# EAGLE schematic mainboard (EAGLE 6.5.0)
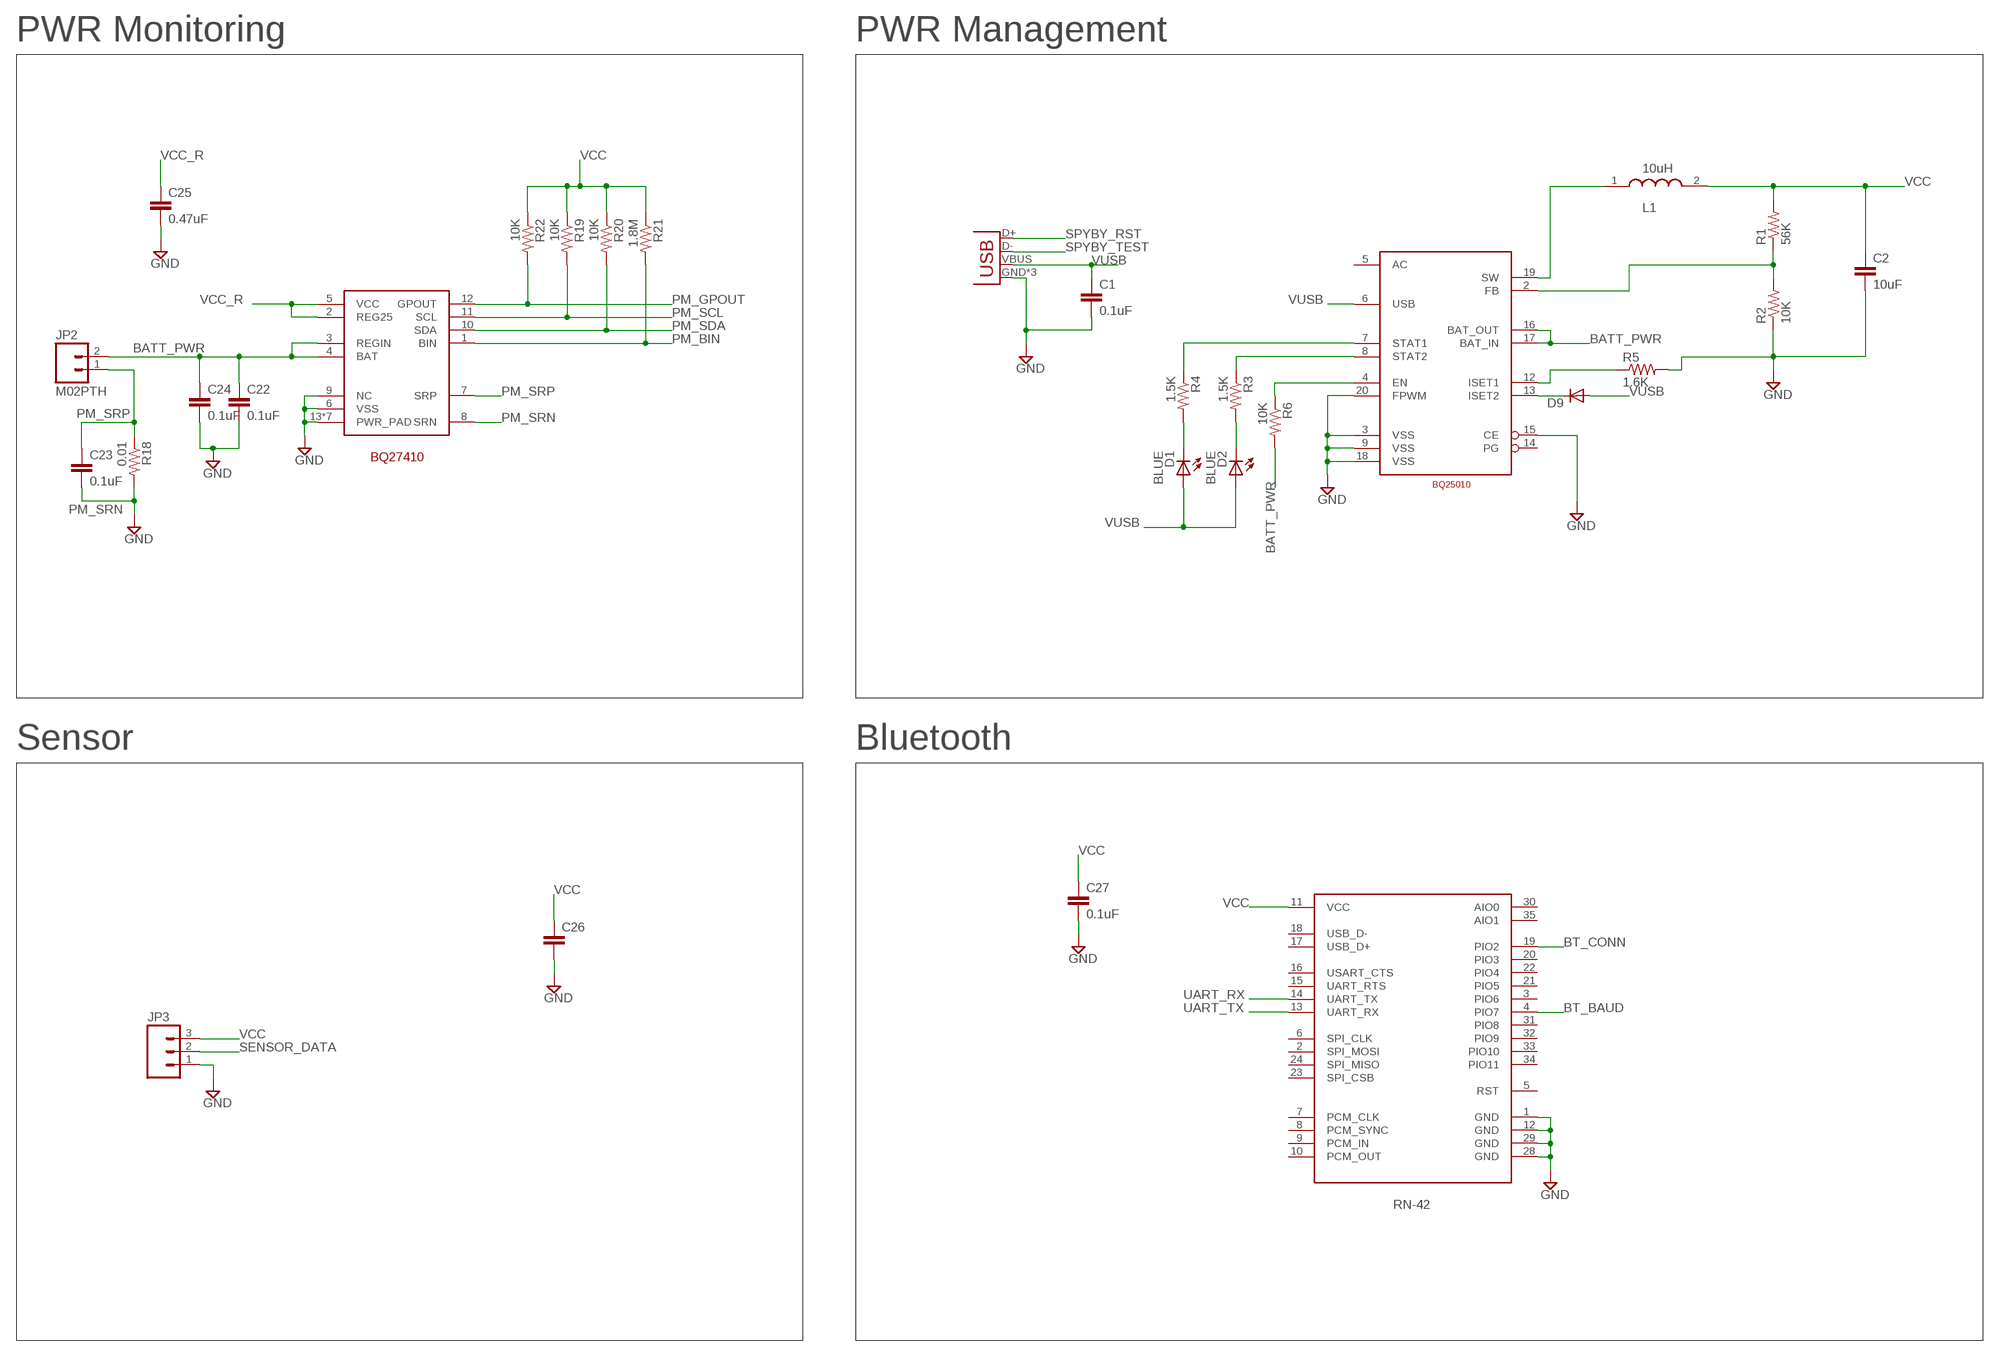
[diagram p0: schematic, sheet 1, part 1 of 2]
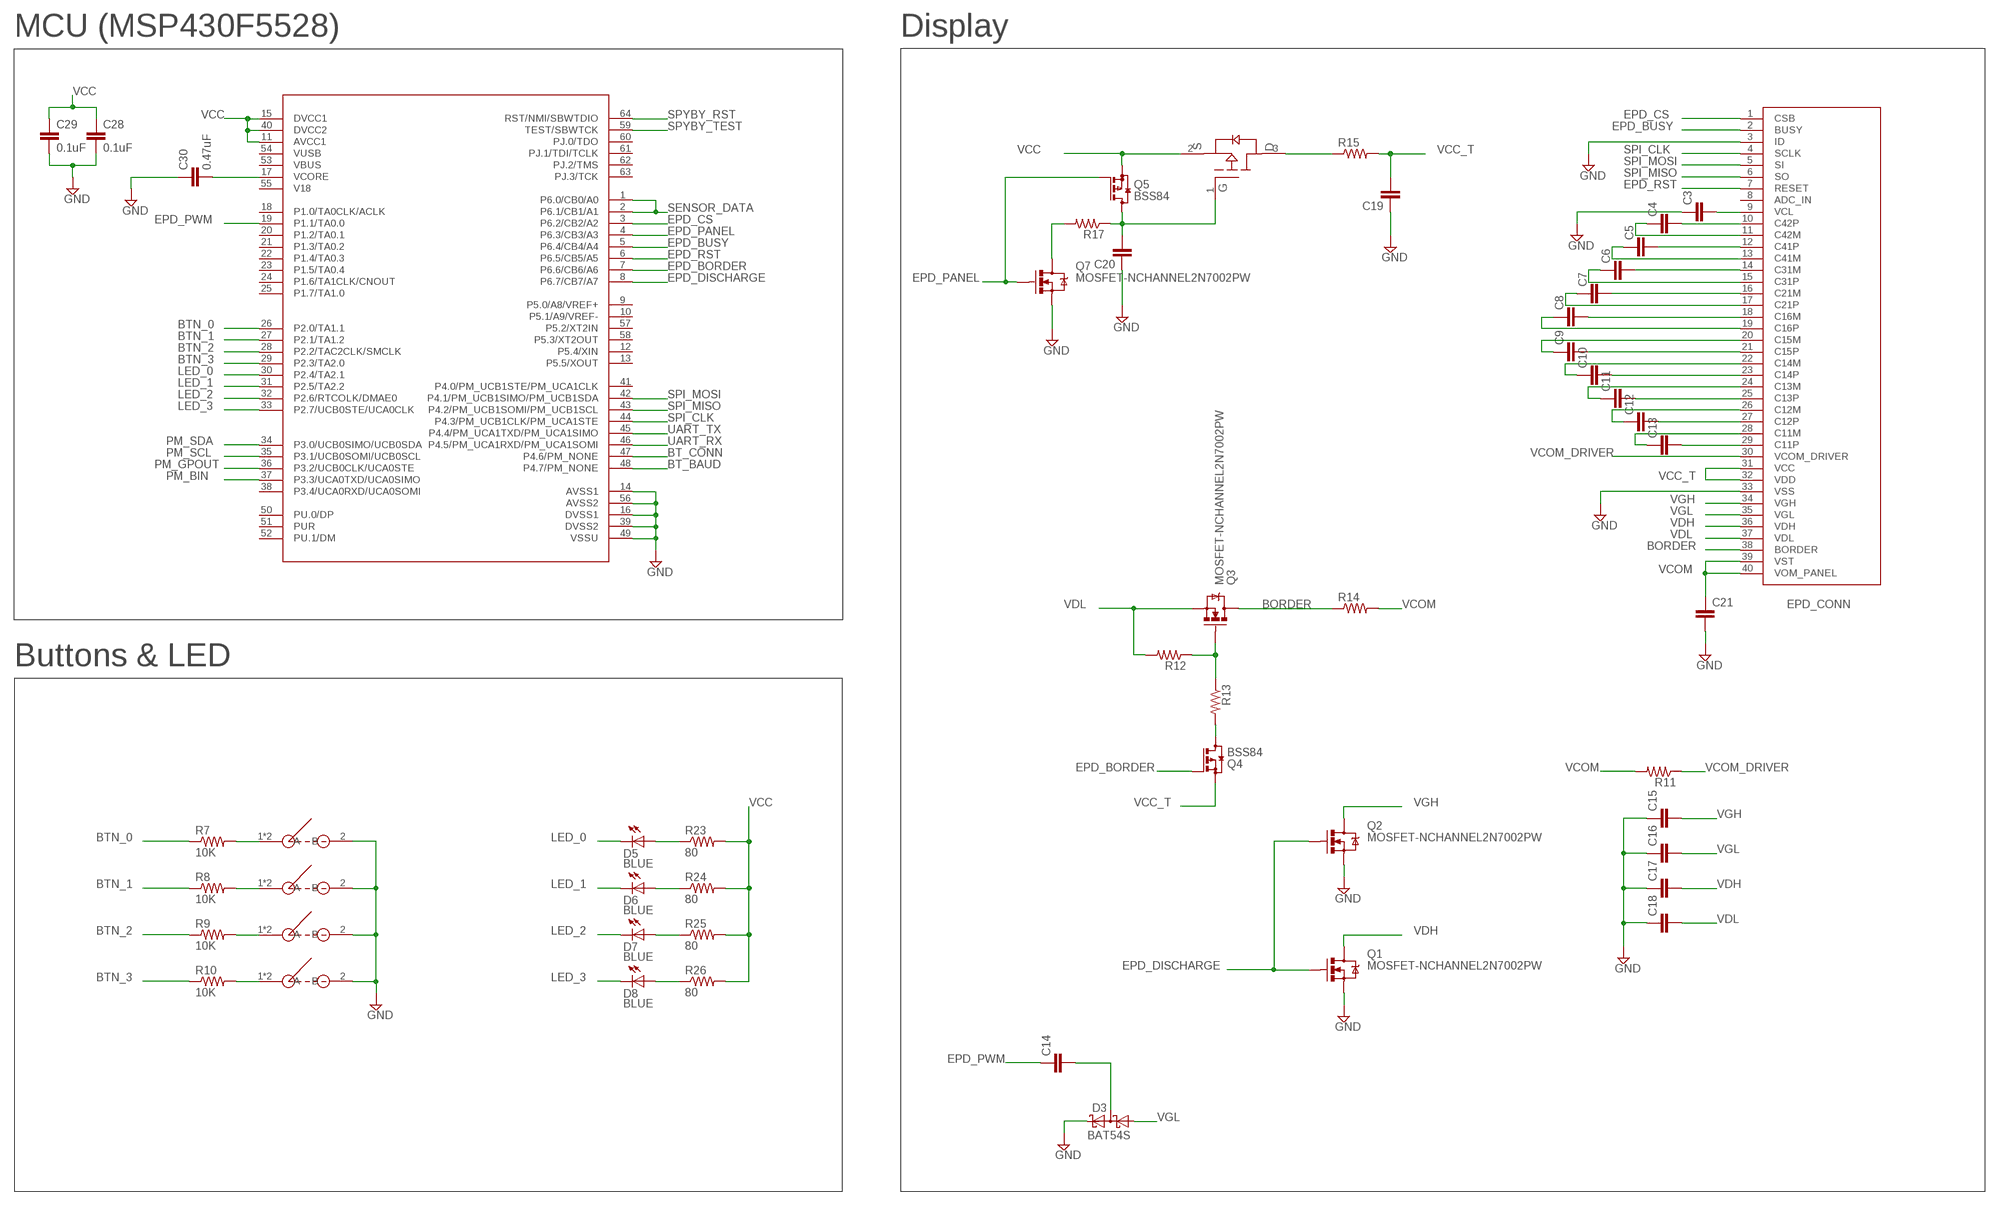
[diagram p1: schematic, sheet 1, part 2 of 2]

## Parts
C1  0.1uF  CAP0402-CAP  [0402-CAP]
C2  10uF  CAP0402-CAP  [0402-CAP]
C3  CAP0402-CAP  [0402-CAP]
C4  CAP0402-CAP  [0402-CAP]
C5  CAP0402-CAP  [0402-CAP]
C6  CAP0402-CAP  [0402-CAP]
C7  CAP0402-CAP  [0402-CAP]
C8  CAP0402-CAP  [0402-CAP]
C9  CAP0402-CAP  [0402-CAP]
C10  CAP0402-CAP  [0402-CAP]
C11  CAP0402-CAP  [0402-CAP]
C12  CAP0402-CAP  [0402-CAP]
C13  CAP0402-CAP  [0402-CAP]
C14  CAP0402-CAP  [0402-CAP]
C15  CAP0402-CAP  [0402-CAP]
C16  CAP0402-CAP  [0402-CAP]
C17  CAP0402-CAP  [0402-CAP]
C18  CAP0402-CAP  [0402-CAP]
C19  CAP0402-CAP  [0402-CAP]
C20  CAP0402-CAP  [0402-CAP]
C21  CAP0402-CAP  [0402-CAP]
C22  0.1uF  CAP0402-CAP  [0402-CAP]
C23  0.1uF  CAP0402-CAP  [0402-CAP]
C24  0.1uF  CAP0402-CAP  [0402-CAP]
C25  0.47uF  CAP0402-CAP  [0402-CAP]
C26  CAP0402-CAP  [0402-CAP]
C27  0.1uF  CAP0402-CAP  [0402-CAP]
C28  0.1uF  CAP0402-CAP  [0402-CAP]
C29  0.1uF  CAP0402-CAP  [0402-CAP]
C30  0.47uF  CAP0402-CAP  [0402-CAP]
D1  BLUE  LED-BLUE0603  [LED-0603]
D2  BLUE  LED-BLUE0603  [LED-0603]
D3  BAT54S  [SOT23]
D5  BLUE  LED-BLUE0603  [LED-0603]
D6  BLUE  LED-BLUE0603  [LED-0603]
D7  BLUE  LED-BLUE0603  [LED-0603]
D8  BLUE  LED-BLUE0603  [LED-0603]
D9  DIODESOD523  [SOD523]
JP1  USB-MICROB  [USB-MICROB]
JP2  M02PTH  [1X02]
JP3  M03PTH  [1X03]
L1  10uH  ASPI-0428S-100M-T  [ASPI_0428S-100M-T]
Q1  MOSFET-NCHANNEL2N7002PW  [SOT323]
Q2  MOSFET-NCHANNEL2N7002PW  [SOT323]
Q3  MOSFET-NCHANNEL2N7002PW  [SOT323]
Q4  BSS84  [SOT23]
Q5  BSS84  [SOT23]
Q7  MOSFET-NCHANNEL2N7002PW  [SOT323]
R1  56K  RESISTOR0402-RES  [0402-RES]
R2  10K  RESISTOR0402-RES  [0402-RES]
R3  1.5K  RESISTOR0402-RES  [0402-RES]
R4  1.5K  RESISTOR0402-RES  [0402-RES]
R5  1.6K  RESISTOR0402-RES  [0402-RES]
R6  10K  RESISTOR0402-RES  [0402-RES]
R7  10K  RESISTOR0402-RES  [0402-RES]
R8  10K  RESISTOR0402-RES  [0402-RES]
R9  10K  RESISTOR0402-RES  [0402-RES]
R10  10K  RESISTOR0402-RES  [0402-RES]
R11  RESISTOR0402-RES  [0402-RES]
R12  RESISTOR0402-RES  [0402-RES]
R13  RESISTOR0402-RES  [0402-RES]
R14  RESISTOR0402-RES  [0402-RES]
R15  RESISTOR0402-RES  [0402-RES]
R17  RESISTOR0402-RES  [0402-RES]
R18  0.01  RESISTOR0402-RES  [0402-RES]
R19  10K  RESISTOR0402-RES  [0402-RES]
R20  10K  RESISTOR0402-RES  [0402-RES]
R21  1.8M  RESISTOR0402-RES  [0402-RES]
R22  10K  RESISTOR0402-RES  [0402-RES]
R23  80  RESISTOR0402-RES  [0402-RES]
R24  80  RESISTOR0402-RES  [0402-RES]
R25  80  RESISTOR0402-RES  [0402-RES]
R26  80  RESISTOR0402-RES  [0402-RES]
U$1  MSP430F5528  [VQFN_RGC_64PIN]
U$2  RN-42  [RN-42]
U$3  BQ25010  [VQFN_RHL_20PIN]
U$4  EVP-AEDB2A  [EVP-AEDB2A]
U$5  EVP-AEDB2A  [EVP-AEDB2A]
U$6  EVP-AEDB2A  [EVP-AEDB2A]
U$7  EVP-AEDB2A  [EVP-AEDB2A]
U$8  FH12-40S-0.5SH  [FH12-40S-0.5SH]
U$9  BQ27410  [SON_DRZ_12PIN]
U$10  DMG2305UX  [SOT23]

## Nets
BATT_PWR: C22.1 C24.1 JP2.2 R6.2 U$3.16(BAT_OUT) U$3.17(BAT_IN) U$9.3(REGIN) U$9.4(BAT)
BORDER: Q3.3(D) R14.1 U$8.38(BORDER)
BT_BAUD: U$1.48(P4.7/PM_NONE) U$2.4(PIO7)
BT_CONN: U$1.47(P4.6/PM_NONE) U$2.19(PIO2)
BTN_0: R7.1 U$1.26(P2.0/TA1.1)
BTN_1: R8.1 U$1.27(P2.1/TA1.2)
BTN_2: R9.1 U$1.28(P2.2/TAC2CLK/SMCLK)
BTN_3: R10.1 U$1.29(P2.3/TA2.0)
EPD_BORDER: Q4.1(G) U$1.7(P6.6/CB6/A6)
EPD_BUSY: U$1.5(P6.4/CB4/A4) U$8.2(BUSY)
EPD_CS: U$1.3(P6.2/CB2/A2) U$8.1(CSB)
EPD_DISCHARGE: Q1.1(G) Q2.1(G) U$1.8(P6.7/CB7/A7)
EPD_PANEL: Q5.1(G) Q7.1(G) U$1.4(P6.3/CB3/A3)
EPD_PWM: C14.1 U$1.19(P1.1/TA0.0)
EPD_RST: U$1.6(P6.5/CB5/A5) U$8.7(RESET)
GND: C1.2 C2.2 C3.1 C15.1 C16.1 C17.1 C18.1 C19.1 C20.1 C21.2 C22.2 C24.2 C25.2 C26.2 C27.2 C28.2 C29.2 C30.1 D3.2(C2) JP1.GND JP1.MT1(GND) JP1.MT2(GND) JP3.1 Q1.2(S) Q2.2(S) Q7.2(S) R2.1 R5.2 U$1.14(AVSS1) U$1.16(DVSS1) U$1.39(DVSS2) U$1.49(VSSU) U$1.56(AVSS2) U$2.1(GND) U$2.12(GND) U$2.28(GND) U$2.29(GND) U$3.3(VSS) U$3.9(VSS) U$3.15(CE) U$3.18(VSS) U$3.20(FPWM) U$4.2(B) U$5.2(B) U$6.2(B) U$7.2(B) U$8.3(ID) U$8.33(VSS) U$9.6(VSS) U$9.9(NC) U$9.13(PWR_PAD) U$9.P$15(PWR_PAD) U$9.P$16(PWR_PAD) U$9.P$17(PWR_PAD) U$9.P$18(PWR_PAD) U$9.P$19(PWR_PAD) U$9.P$20(PWR_PAD)
LED_0: D5.C U$1.30(P2.4/TA2.1)
LED_1: D6.C U$1.31(P2.5/TA2.2)
LED_2: D7.C U$1.32(P2.6/RTCOLK/DMAE0)
LED_3: D8.C U$1.33(P2.7/UCB0STE/UCA0CLK)
N$1: R5.1 U$3.12(ISET1)
N$2: D1.C R4.2
N$3: D9.C U$3.13(ISET2)
N$4: D2.C R3.2
N$5: R1.1 R2.2 U$3.2(FB)
N$6: L1.1 U$3.19(SW)
N$7: C30.2 U$1.17(VCORE)
N$8: Q4.3(D) R13.2
N$9: C14.2 D3.3(C1A2)
N$10: R4.1 U$3.7(STAT1)
N$11: R3.1 U$3.8(STAT2)
N$12: R6.1 U$3.4(EN)
N$13: R7.2 U$4.1'(A) U$4.1(A)
N$14: R8.2 U$5.1'(A) U$5.1(A)
N$15: R9.2 U$6.1'(A) U$6.1(A)
N$16: R10.2 U$7.1'(A) U$7.1(A)
N$26: C4.2 U$8.10(C42P)
N$27: C4.1 U$8.11(C42M)
N$28: C5.2 U$8.12(C41P)
N$29: C5.1 U$8.13(C41M)
N$30: C6.2 U$8.14(C31M)
N$31: C6.1 U$8.15(C31P)
N$32: C7.2 U$8.16(C21M)
N$33: C7.1 U$8.17(C21P)
N$34: C8.2 U$8.18(C16M)
N$35: C8.1 U$8.19(C16P)
N$36: C9.1 U$8.20(C15M)
N$37: C9.2 U$8.21(C15P)
N$38: C10.1 U$8.22(C14M)
N$39: C10.2 U$8.23(C14P)
N$40: C11.1 U$8.24(C13M)
N$41: C11.2 U$8.25(C13P)
N$42: C12.1 U$8.26(C12M)
N$43: C12.2 U$8.27(C12P)
N$44: C13.1 U$8.28(C11M)
N$45: C13.2 U$8.29(C11P)
N$46: C3.2 U$8.9(VCL)
N$47: R15.1 U$10.3(DRAIN)
N$48: D5.A R23.1
N$49: Q3.1(G) R12.1 R13.1
N$50: C20.2 Q5.3(D) R17.1 U$10.1(GATE)
N$51: D6.A R24.1
N$52: Q7.3(D) R17.2
N$55: D7.A R25.1
N$56: D8.A R26.1
PM_BIN: R21.2 U$1.37(P3.3/UCA0TXD/UCA0SIMO) U$9.1(BIN)
PM_GPOUT: R22.2 U$1.36(P3.2/UCB0CLK/UCA0STE) U$9.12(GPOUT)
PM_SCL: R19.2 U$1.35(P3.1/UCB0SOMI/UCB0SCL) U$9.11(SCL)
PM_SDA: R20.2 U$1.34(P3.0/UCB0SIMO/UCB0SDA) U$9.10(SDA)
PM_SRN: C23.2 R18.2 U$9.8(SRN) ; supply symbol labelled GND
PM_SRP: C23.1 JP2.1 R18.1 U$9.7(SRP)
SENSOR_DATA: JP3.2 U$1.1(P6.0/CB0/A0) U$1.2(P6.1/CB1/A1)
SPI_CLK: U$1.44(P4.3/PM_UCB1CLK/PM_UCA1STE) U$8.4(SCLK)
SPI_MISO: U$1.43(P4.2/PM_UCB1SOMI/PM_UCB1SCL) U$8.6(SO)
SPI_MOSI: U$1.42(P4.1/PM_UCB1SIMO/PM_UCB1SDA) U$8.5(SI)
SPYBY_RST: JP1.D+ U$1.64(RST/NMI/SBWTDIO)
SPYBY_TEST: JP1.D- U$1.59(TEST/SBWTCK)
UART_RX: U$1.46(P4.5/PM_UCA1RXD/PM_UCA1SOMI) U$2.14(UART_TX)
UART_TX: U$1.45(P4.4/PM_UCA1TXD/PM_UCA1SIMO) U$2.13(UART_RX)
VCC: C2.1 C26.1 C27.1 C28.1 C29.1 JP3.3 L1.2 Q5.2(S) R1.2 R19.1 R20.1 R21.1 R22.1 R23.2 R24.2 R25.2 R26.2 U$1.11(AVCC1) U$1.15(DVCC1) U$1.40(DVCC2) U$2.11(VCC) U$10.2(SOURCE)
VCC_R: C25.1 U$9.2(REG25) U$9.5(VCC)
VCC_T: C19.2 Q4.2(S) R15.2 U$8.31(VCC) U$8.32(VDD)
VCOM: C21.1 R11.2 R14.2 U$8.39(VST) U$8.40(VOM_PANEL)
VCOM_DRIVER: R11.1 U$8.30(VCOM_DRIVER)
VDH: C17.2 Q1.3(D) U$8.36(VDH)
VDL: C18.2 Q3.2(S) R12.2 U$8.37(VDL)
VGH: C15.2 Q2.3(D) U$8.34(VGH)
VGL: C16.2 D3.1(A1) U$8.35(VGL)
VUSB: C1.1 D1.A D2.A D9.A JP1.VBUS U$3.6(USB)
Unconnected: U$1.9(P5.0/A8/VREF+) U$1.10(P5.1/A9/VREF-) U$1.12(P5.4/XIN) U$1.13(P5.5/XOUT) U$1.18(P1.0/TA0CLK/ACLK) U$1.20(P1.2/TA0.1) U$1.21(P1.3/TA0.2) U$1.22(P1.4/TA0.3) U$1.23(P1.5/TA0.4) U$1.24(P1.6/TA1CLK/CNOUT) U$1.25(P1.7/TA1.0) U$1.38(P3.4/UCA0RXD/UCA0SOMI) U$1.41(P4.0/PM_UCB1STE/PM_UCA1CLK) U$1.50(PU.0/DP) U$1.51(PUR) U$1.52(PU.1/DM) U$1.53(VBUS) U$1.54(VUSB) U$1.55(V18) U$1.57(P5.2/XT2IN) U$1.58(P5.3/XT2OUT) U$1.60(PJ.0/TDO) U$1.61(PJ.1/TDI/TCLK) U$1.62(PJ.2/TMS) U$1.63(PJ.3/TCK) U$2.2(SPI_MOSI) U$2.3(PIO6) U$2.5(RST) U$2.6(SPI_CLK) U$2.7(PCM_CLK) U$2.8(PCM_SYNC) U$2.9(PCM_IN) U$2.10(PCM_OUT) U$2.15(UART_RTS) U$2.16(USART_CTS) U$2.17(USB_D+) U$2.18(USB_D-) U$2.20(PIO3) U$2.21(PIO5) U$2.22(PIO4) U$2.23(SPI_CSB) U$2.24(SPI_MISO) U$2.30(AIO0) U$2.31(PIO8) U$2.32(PIO9) U$2.33(PIO10) U$2.34(PIO11) U$2.35(AIO1) U$3.5(AC) U$3.14(PG) U$8.8(ADC_IN)

## Notes on the sheet
- PWR Monitoring | PWR Management | MCU (MSP430F5528) | Display
- 10uH
- L1
- Sensor | Bluetooth | Buttons & LED

## Library data of the parts
C1-C30 = SparkFun-Capacitors:CAP: Capacitor Standard 0603 ceramic capacitor, and 0.1" leaded capacitor.
D1 D2 D5-D8 = SparkFun-LED:LED-BLUE: Blue LEDs for production use Various blue LEDs stocked by SparkFun production 0603 - DIO-08575 Rebel - DIO-09553 1206 - DIO-09911; PROD_ID: DIO-08575
D3 = diode:BAT54S: Schottky Diodes Pin connection corrected 2011-05-04 Source: Fairchild .. BAT54.pdf
D9 = SparkFun-DiscreteSemi:DIODE: Diode These are standard reverse protection diodes and small signal diodes. SMA package can handle up to about 1A. SOD-323 can handle about 200mA. What the SOD-323 package when ordering, there are some mfgs out there that are 5-pin packages.
JP1 = SparkFun-Connectors:USB: USB Connectors USB-B-PTH is fully proven SKU : PRT-00139/CONN-08278 USB-miniB is fully proven SKU : PRT-00587 USB-A-PCB is untested. USB-A-H is throughly reviewed, but untested. Spark Fun Electronics SKU : PRT-00437 USB-B-SMT is throughly reviewed, but untested. Needs silkscreen touching up. USB-A-S has not been used/tested USB-MB-H has not been used/tested USB-MICROB has been used. CONN-09505; PROD_ID: CONN-09505
JP2 = SparkFun-Connectors:M02: Standard 2-pin 0.1" header. Use with - straight break away headers ( PRT-00116) - right angle break away headers (PRT-00553) - swiss pins (PRT-00743) - machine pins (PRT-00117) - female headers (PRT-00115) Molex polarized connector foot print use with: PRT-08233 with associated crimp pins and housings. 2.54_SCREWTERM for use with PRT-10571. 3.5mm Screw Terminal footprints for PRT-08084 5mm Screw Terminal footprints for use with PRT-08433
JP3 = SparkFun-Connectors:M03: Header 3 Standard 3-pin 0.1" header. Use with straight break away headers (SKU : PRT-00116), right angle break away headers (PRT-00553), swiss pins (PRT-00743), machine pins (PRT-00117), and female headers (PRT-00115). Molex polarized connector foot print use with SKU : PRT-08232 with associated crimp pins and housings.
L1 = TuansLib:ASPI-0428S-100M-T
Q1-Q3 Q7 = SparkFun-DiscreteSemi:MOSFET-NCHANNEL: Common NMOSFET Parts MFG P/N Store ID Prod ID FDD8780 TRANS-09984 SI7820DN TRANS-11055 FDS6630A IC-08089 2N7002PW TRANS-11151 FQP30N06L COM-10213 TRANS-10060 BSS123LT1G TRANS-08345 BSS138 TRANS-00830 BS170 2N7000; PROD_ID: TRANS-11151
Q4 Q5 = transistor-small-signal:BSS84: P-CHANNEL MOS FET
R1-R15 R17-R26 = SparkFun-Passives:RESISTOR: Resistor Basic schematic elements and footprints for 0603, 1206, and PTH resistors.
U$1 = TuansLib:MSP430F5528
U$2 = TuansLib:RN-42
U$3 = TuansLib:BQ25010
U$4-U$7 = TuansLib:EVP-AEDB2A
U$8 = TuansLib:FH12-40S-0.5SH
U$9 = TuansLib:BQ27410
U$10 = TuansLib:DMG2305UX